# Altium schematic sheet main.SchDoc
size A; SheetNumber: 1; SheetTotal: 1
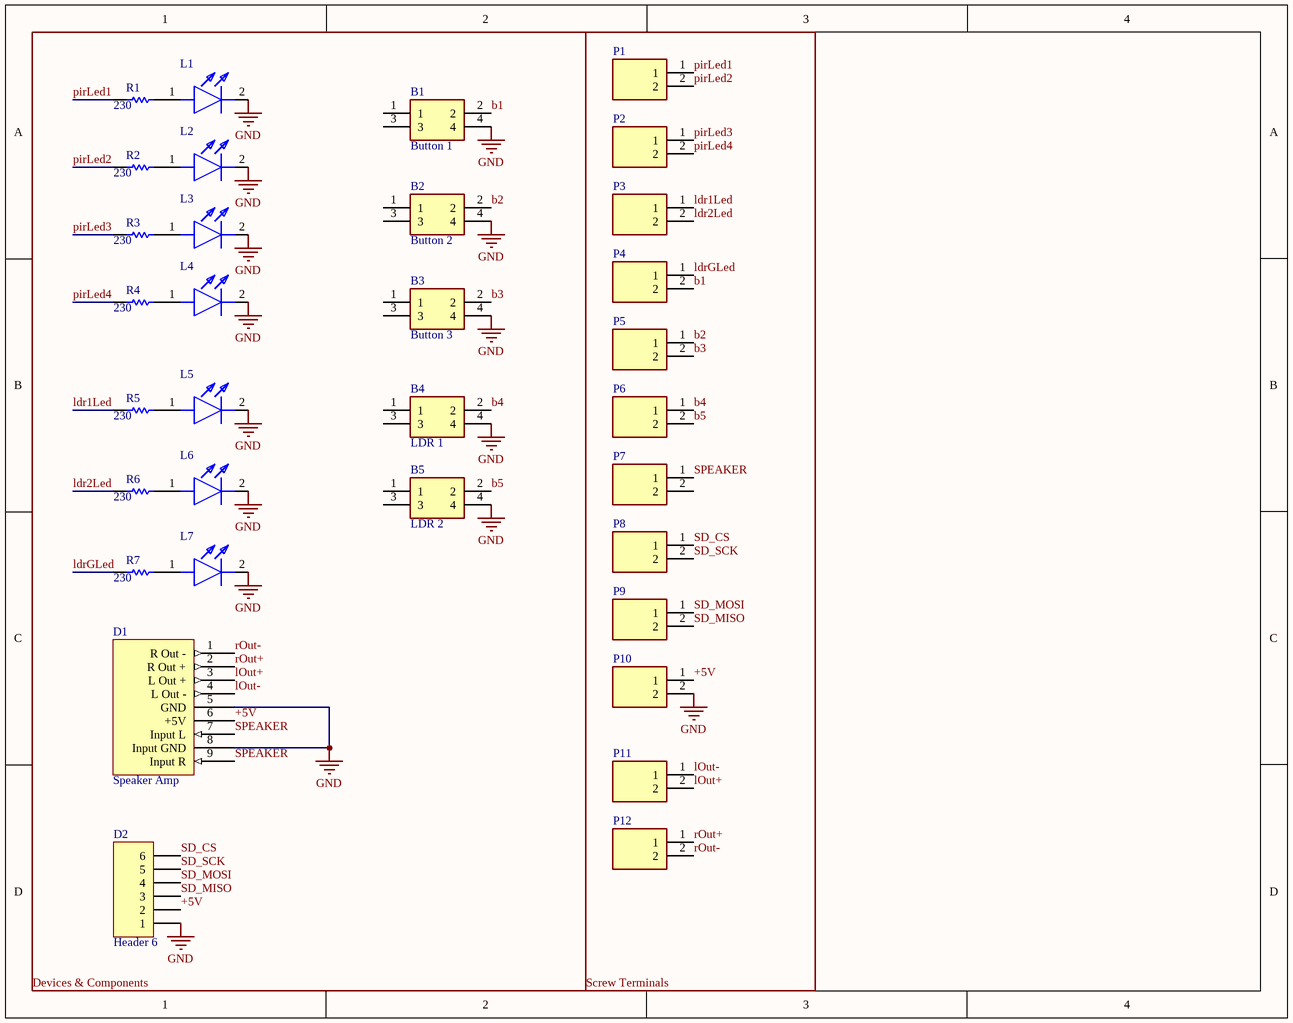
[diagram p0: main.SchDoc]

## Parts
B1  Button 1  [FSM4JH]
B2  Button 2  [FSM4JH]
B3  Button 3  [FSM4JH]
B4  LDR 1  [FSM4JH]
B5  LDR 2  [FSM4JH]
D1  Speaker Amp  [HiLetgo PAM8403 Amp Module]
D2  Header 6  [HDR1X6]
L1  (no value)  [C5SMFRJECT0W0BB2]
L2  (no value)  [C5SMFRJECT0W0BB2]
L3  (no value)  [C5SMFRJECT0W0BB2]
L4  (no value)  [C5SMFRJECT0W0BB2]
L5  (no value)  [C5SMFRJECT0W0BB2]
L6  (no value)  [C5SMFRJECT0W0BB2]
L7  (no value)  [C5SMFRJECT0W0BB2]
P1  (no value)  [TB00250002BE]
P2  (no value)  [TB00250002BE]
P3  (no value)  [TB00250002BE]
P4  (no value)  [TB00250002BE]
P5  (no value)  [TB00250002BE]
P6  (no value)  [TB00250002BE]
P7  (no value)  [TB00250002BE]
P8  (no value)  [TB00250002BE]
P9  (no value)  [TB00250002BE]
P10  (no value)  [TB00250002BE]
P11  (no value)  [TB00250002BE]
P12  (no value)  [TB00250002BE]
R1  value 230  [AXIAL-0.3]  (hidden comment: 230 Ohm)
R2  value 230  [AXIAL-0.3]  (hidden comment: 230 Ohm)
R3  value 230  [AXIAL-0.3]  (hidden comment: 230 Ohm)
R4  value 230  [AXIAL-0.3]  (hidden comment: 230 Ohm)
R5  value 230  [AXIAL-0.3]  (hidden comment: 230 Ohm)
R6  value 230  [AXIAL-0.3]  (hidden comment: 230 Ohm)
R7  value 230  [AXIAL-0.3]  (hidden comment: 230 Ohm)

## Blocks framed on the sheet
Devices & Components: B1-B5 D1 D2 L1-L7 R1-R7
Screw Terminals: P1-P12

## Nets
GND: B1.4 B2.4 B3.4 B4.4 B5.4 D1.5(GND) D1.8(Input_GND) D2.1 L1.2(K) L2.2(K) L3.2(K) L4.2(K) L5.2(K) L6.2(K) L7.2(K) P10.2
+5V: D1.6(+5V) D2.2 P10.1
b1: B1.2 P4.2
b2: B2.2 P5.1
b3: B3.2 P5.2
b4: B4.2 P6.1
b5: B5.2 P6.2
ldr1Led: P3.1 R5.1
ldr2Led: P3.2 R6.1
ldrGLed: P4.1 R7.1
lOut+: D1.3(L_Out_+) P11.2
lOut-: D1.4(L_Out_-) P11.1
pirLed1: P1.1 R1.1
pirLed2: P1.2 R2.1
pirLed3: P2.1 R3.1
pirLed4: P2.2 R4.1
rOut+: D1.2(R_Out_+) P12.1
rOut-: D1.1(R_Out_-) P12.2
SD_CS: D2.6 P8.1
SD_MISO: D2.3 P9.2
SD_MOSI: D2.4 P9.1
SD_SCK: D2.5 P8.2
SPEAKER: D1.7(Input_L) D1.9(Input_R) P7.1
NetL1_1: L1.1(A) R1.2
NetL2_1: L2.1(A) R2.2
NetL3_1: L3.1(A) R3.2
NetL4_1: L4.1(A) R4.2
NetL5_1: L5.1(A) R5.2
NetL6_1: L6.1(A) R6.2
NetL7_1: L7.1(A) R7.2

Not connected (* = marked no-connect by the designer): B1 1 3; B2 1 3; B3 1 3; B4 1 3; B5 1 3; P7 2

## Library data of the parts
B1-B5 = FSM2JAH: Tactile Pushbutton; Manufacturer_Name: TE Connectivity; Datasheet Link: http://www.te.com/commerce/DocumentDelivery/DDEController?Action=showdoc&DocId=Customer+Drawing%7F1825910%7FC9%7Fpdf%7FEnglish%7FENG_CD_1825910_C9.pdf%7F1825910-3; Manufacturer_Part_Number: FSM2JAH; Mouser Part Number: 506-FSM2JAH; Mouser Price/Stock: https://www.mouser.co.uk/ProductDetail/TE-Connectivity-PB/FSM2JAH?qs=Of7OaoM7rsH02ckr%252BGLHNA%3D%3D
D1 = HiLetgo PAM8403 Module: https://www.amazon.com/dp/B01DKAI51M?psc=1&smid=A30QSGOJR8LMXA&ref_=chk_typ_imgToDp
D2 = Header 6: Header, 6-Pin; LatestRevisionDate: 17-Jul-2002; LatestRevisionNote: Re-released for DXP Platform.; Publisher: Altium Limited
L1-L7 = C5SMF-RJE-CT0W0BB2: LED; Manufacturer_Name: Wolfspeed; Datasheet Link: https://www.mouser.com/datasheet/2/723/C5SMF_RJF_RJE_GJF_GJE_BJF_BJE_1240-2256911.pdf; Height: 8.75mm; Manufacturer_Part_Number: C5SMF-RJE-CT0W0BB2; Mouser Part Number: 941-C5SMFRJECT0W0BB2; Mouser Price/Stock: https://www.mouser.co.uk/ProductDetail/Cree-LED/C5SMF-RJE-CT0W0BB2?qs=1sbE9T7hb3bz%2FXMFB8lsHw%3D%3D; Arrow Part Number: C5SMF-RJE-CT0W0BB2; Arrow Price/Stock: https://www.arrow.com/en/products/c5smf-rje-ct0w0bb2/cree-led?region=nac
P1-P12 = TB002-500-02BE: Connector; Manufacturer_Name: CUI Devices; Datasheet Link: https://eu.mouser.com/datasheet/2/670/tb002_500-1550579.pdf; Height: 10.4mm; Manufacturer_Part_Number: TB002-500-02BE; Mouser Part Number: 490-TB002-500-02BE; Mouser Price/Stock: https://www.mouser.co.uk/ProductDetail/CUI-Devices/TB002-500-02BE?qs=vLWxofP3U2x9716kcgva%2Fw%3D%3D; Arrow Part Number: TB002-500-02BE; Arrow Price/Stock: https://www.arrow.com/en/products/tb002-500-02be/cui-devices?region=nac
R1-R7 = Res1: Resistor; Published: 8-Jun-2000; LatestRevisionDate: 17-Jul-2002; LatestRevisionNote: Re-released for DXP Platform.; PackageReference: AXIAL-0.3; Publisher: Altium Limited; PackageDescription: Axial Device, Thru-Hole; 2 Leads; 0.3 in Pin Spacing